# EAGLE design DS1339 RTC Module (EAGLE 9.4.2)
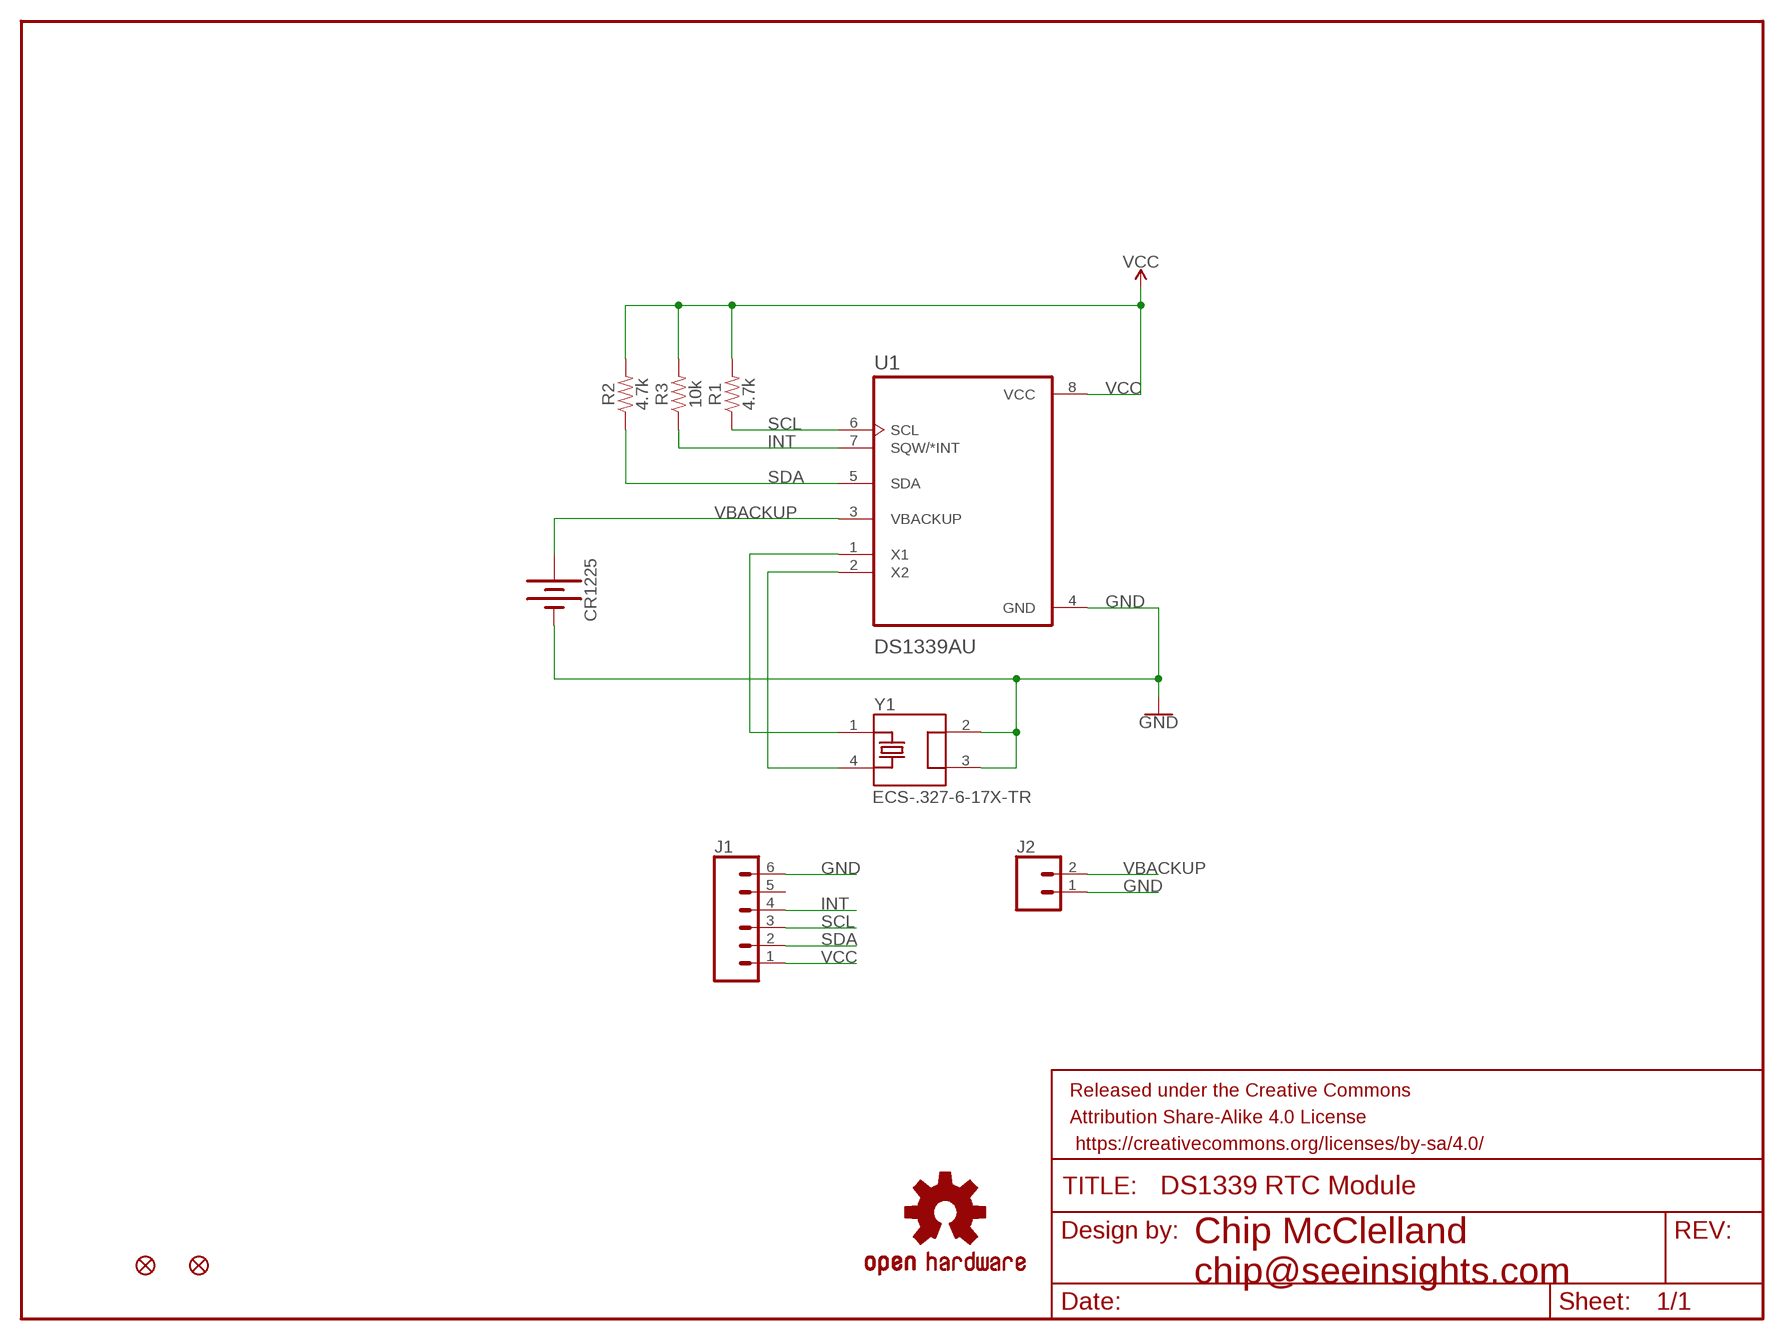
[diagram p0: schematic, sheet 1]

## Parts
CR1225  BATTERY-12MM_SMD  [BATTCON_12MM]
FD1  FIDUCIALUFIDUCIAL  [FIDUCIAL-MICRO]
FD2  FIDUCIALUFIDUCIAL  [FIDUCIAL-MICRO]
FRAME1  FRAME-LETTER  [CREATIVE_COMMONS]
J1  CONN_06LOCK  [1X06_LOCK]
J2  CONN_02  [1X02]
LOGO1  OSHW-LOGOMINI  [OSHW-LOGO-MINI]
R1  4.7k  RESISTOR0805  [0805]
R2  4.7k  RESISTOR0805  [0805]
R3  10k  RESISTOR0805  [0805]
U1  DS1339AU  [SOP65P490X110-8N]
Y1  ECS-.327-6-17X-TR  [XTAL_ECS-.327-6-17X-TR]

## Nets
GND: CR1225.GND(-) J1.6 J2.1 U1.4(GND) Y1.2 Y1.3
INT: J1.4 R3.1 U1.7(SQW/*INT)
N$1: U1.1(X1) Y1.1
N$2: U1.2(X2) Y1.4
SCL: J1.3 R1.1 U1.6(SCL)
SDA: J1.2 R2.1 U1.5(SDA)
VBACKUP: CR1225.PWR@2(+) J2.2 U1.3(VBACKUP)
VCC: J1.1 R1.2 R2.2 R3.2 U1.8(VCC)
Unconnected: J1.5

## Notes on the sheet
- Chip McClelland
  chip@seeinsights.com

## Library data of the parts
CR1225 = DS1339 RTC Library:BATTERY: Battery - Single Cell A variety of battery chemistries, sizes, and footprints. Device List: 20MM_PTH - Coin Cell Battery Holder - 20mm (PTH) <https://www.sparkfun.com/products/783> 20MM_PTH_KIT- Coin Cell battery Holder - 20 mm (PTH) <http://www.sparkfun.com/products/783>kit version with special mask 6.8MM_PTH - Coin Cell Battery Holder - 6.8MM(SMD) <https://www.digikey.com/product-detail/en/seiko-instruments/MS621FE-FL11E/728-1057-ND/1889208?WT.srch=1&gclid=CNOQ5a6LzdQCFZS2wAodXCkE0g> 12MM_SMD - Coin Cell Battery Holder - 12mm (SMD) <https://www.sparkfun.com/products/10592> 12MM_PTH - Coin Cell Battery Holder - 12mm (PTH) <https://www.sparkfun.com/products/7948> 20MM_SMD - 20mm Coin Cell Battery Holder (SMD) (2 legs) Used on the Big Time Watch Kit <https://www.sparkfun.com/products/11734> 20MM_SMD_4LEGS - Coin Cell Battery Holder - 20mm (SMD) <https://www.sparkfun.com/products/11892> 20MM_SMD_4LEGS_OVERPASTE - Coin Cell Battery Holder - 20mm (SMD) <https://www.sparkfun.com/products/11892> (Over-paste on the legs) 24.5MM_PTH - Coin Cell Battery Holder - 24.5mm (PTH) <https://www.sparkfun.com/products/8863> 9V - 9V Battery Holder - PC Mount Used on the SparkFun SparkPunk Sound Kit <https://www.sparkfun.com/products/11177> and SparkFun SparkPunk Sequencer Kit <https://www.sparkfun.com/products/12707> 18650 - Battery Holder - 18650 (PTH) <https://www.sparkfun.com/products/13113> AA - Battery Holder - 1xAA (PTH) <https://www.sparkfun.com/products/7949> AAA - Battery Holder - 1xAAA (PTH) <https://www.sparkfun.com/products/12718> AA_KIT - Battery Holder - 1xAA (PTH) <https://www.sparkfun.com/products/7949> Special kit package - pads only have exposed copper on one side of the board. AAA_KIT - Battery Holder - 1xAAA (PTH) <https://www.sparkfun.com/products/12718> Special kit package - pads only have exposed copper on one side of the board.; PROD_ID: BATT-08044; SF_SKU: PRT-10592
FD1 FD2 = SparkFun-Aesthetics:FIDUCIAL: Fiducial Alignment Points Point-of-reference for pick-and-place machines and other optical instruments.
FRAME1 = SparkFun-Aesthetics:FRAME-LETTER: Schematic Frame - Letter Standard 8.5x11 US Letter frame
J1 = SparkFun-Connectors:CONN_06: Multi connection point. Often used as Generic Header-pin footprint for 0.1 inch spaced/style header connections On any of the 0.1 inch spaced packages, you can populate with these: Break Away Headers - Straight <https://www.sparkfun.com/products/116> (PRT-00116) Break Away Male Headers - Right Angle <https://www.sparkfun.com/products/553> (PRT-00553) Female Headers <https://www.sparkfun.com/products/115> (PRT-00115) Break Away Headers - Machine Pin <https://www.sparkfun.com/products/117> (PRT-00117) Break Away Female Headers - Swiss Machine Pin <https://www.sparkfun.com/products/743> (PRT-00743) Arduino Stackable Header - 6 Pin <https://www.sparkfun.com/products/9280> (PRT-09280) For SCREWTERMINALS and SPRING TERMINALS visit here: Screw Terimnals on SparkFun.com <https://www.sparkfun.com/search/results?term=Screw+Terminals> (5mm/3.5mm/2.54mm spacing) This device is also useful as a general connection point to wire up your design to another part of your project. Our various solder wires solder well into these plated through hole pads. Hook-Up Wire - Assortment (Stranded, 22 AWG) <https://www.sparkfun.com/products/11375> (PRT-11375) Hook-Up Wire - Assortment (Solid Core, 22 AWG) <https://www.sparkfun.com/products/11367> (PRT-11367) View the entire wire category on our website here <https://www.sparkfun.com/categories/141>
J2 = SparkFun-Connectors:CONN_02: Multi connection point. Often used as Generic Header-pin footprint for 0.1 inch spaced/style header connections On any of the 0.1 inch spaced packages, you can populate with these: Break Away Headers - Straight <https://www.sparkfun.com/products/116> (PRT-00116) Break Away Male Headers - Right Angle <https://www.sparkfun.com/products/553> (PRT-00553) Female Headers <https://www.sparkfun.com/products/115> (PRT-00115) Break Away Headers - Machine Pin <https://www.sparkfun.com/products/117> (PRT-00117) Break Away Female Headers - Swiss Machine Pin <https://www.sparkfun.com/products/743> (PRT-00743) For SCREWTERMINALS and SPRING TERMINALS visit here: Screw Terimnals on SparkFun.com <https://www.sparkfun.com/search/results?term=Screw+Terminals> (5mm/3.5mm/2.54mm spacing) This device is also useful as a general connection point to wire up your design to another part of your project. Our various solder wires solder well into these plated through hole pads. Hook-Up Wire - Assortment (Stranded, 22 AWG) <https://www.sparkfun.com/products/11375> (PRT-11375) Hook-Up Wire - Assortment (Solid Core, 22 AWG) <https://www.sparkfun.com/products/11367> (PRT-11367) View the entire wire category on our website here <https://www.sparkfun.com/categories/141> Special notes: Molex polarized connector foot print use with: PRT-08233 with associated crimp pins and housings. 2.54_SCREWTERM for use with PRT-10571. 3.5mm Screw Terminal footprints for PRT-08084 5mm Screw Terminal footprints for use with PRT-08432
LOGO1 = SparkFun-Aesthetics:OSHW-LOGO: Open-Source Hardware (OSHW) Logo This logo indicates the piece of hardware it is found on incorporates a OSHW license and/or adheres to the definition of open source hardware found here: http://freedomdefined.org/OSHW
R1-R3 = SparkFun-Resistors:RESISTOR: Generic Resistor Package
U1 = DS1339 RTC Library:DS1339AU; DESCRIPTION: Real Time Clock Serial 8-Pin uMAX; DIGI-KEY_PART_NUMBER: DS1339AU+-ND; DIGI-KEY_PURCHASE_URL: https://www.digikey.com/product-detail/en/maxim-integrated/DS1339AU-/DS1339AU--ND/3440513?utm_source=snapeda&utm_medium=aggregator&utm_campaign=symbol; MF: Maxim Integrated; MP: DS1339AU+; PACKAGE: &amp;MICRO;MAX-8 Maxim
Y1 = DS1339 RTC Library:ECS-.327-6-17X-TR: Crystal 4-SOJ, 5.50mm pitch; DESCRIPTION: ECX-306X Series 32.768 kHz ±20 ppm 6 pF -40 to +85 °C SMT Tuning Fork Crystal; DIGI-KEY_PART_NUMBER: XC1307CT-ND; DIGI-KEY_PURCHASE_URL: https://www.digikey.com/product-detail/en/ecs-inc/ECS-.327-6-17X-TR/XC1307CT-ND/827771?utm_source=snapeda&utm_medium=aggregator&utm_campaign=symbol; MF: ECS Inc.; MP: ECS-.327-6-17X-TR; PACKAGE: 4-4 ECS International

## Board
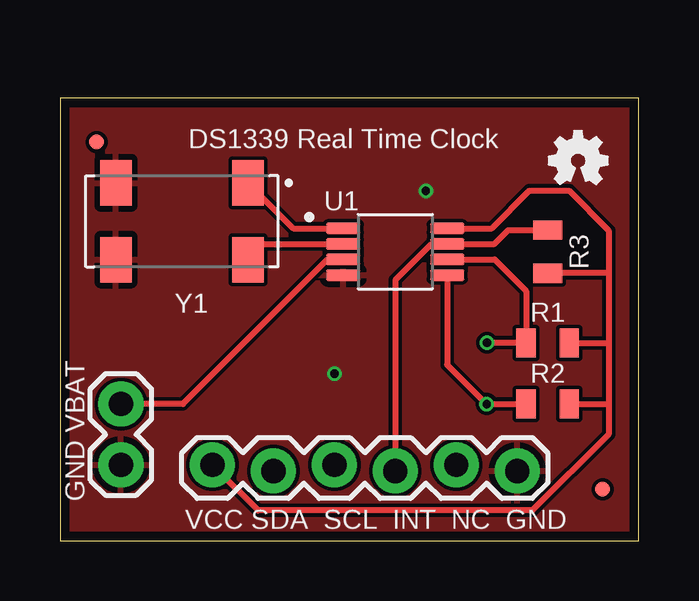
[diagram p1: board, top side]
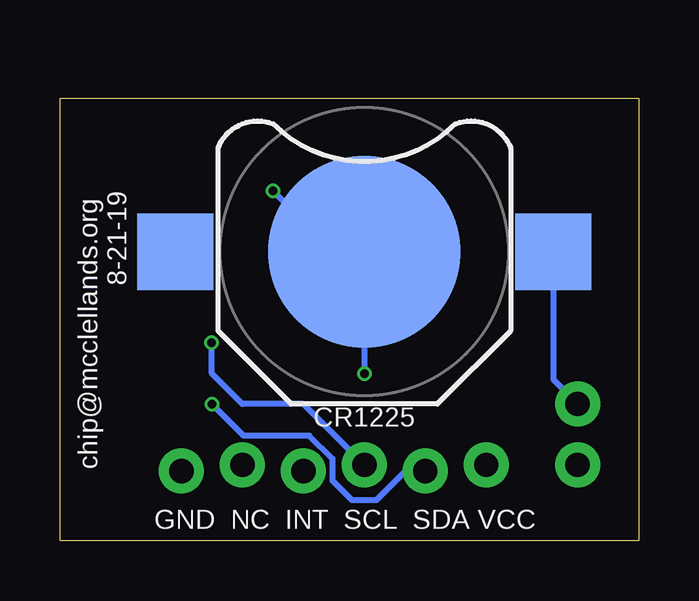
[diagram p2: board, bottom side, seen from below]

Size 24.11 x 18.47 mm. Coordinates in mm from the lower left corner, seen from the top.
Outline: 0,0 24.11,0 24.11,18.47 0,18.47 0,0
Copper layers (1*16): Top 0.035559375mm / dielectric 1.6mm / Bottom 0.035559375mm
Design rules "oshpark-2layer": minimum track width 6mil, minimum drill 10mil, track to track 6mil, track to pad 6mil, pad to pad 6mil, via to via 6mil, smd to smd 6mil, copper to edge 15mil, drill to drill 6mil, minimum pad ring 5mil, minimum via ring 5mil, stop-mask expansion 2.5mil, vias tented up to drill 0mil, thermal gap 10mil

### Footprints (pad centres in the part's own frame; a part is rotated, then mirrored left to right if it is on the bottom)
BATTCON_12MM = smd 8 x 8: GND 0,0 | smd 3.175 x 3.175: PWR@1 -7.874,0; PWR@2 7.874,0
FIDUCIAL-MICRO = smd 0.635 x 0.635: 1 0,0
1X06_LOCK = drill 1.016 pad 1.88: 1 0,0; 2 2.54,-0.254; 3 5.08,0; 4 7.62,-0.254; 5 10.16,0; 6 12.7,-0.254
1X02 = drill 1.016 pad 1.88: 1 0,0; 2 2.54,0
0805 = smd 0.8 x 1.2: 1 -0.9,0; 2 0.9,0
SOP65P490X110-8N = smd 1.42 x 0.47: 1 -2.165,0.975; 2 -2.165,0.325; 3 -2.165,-0.325; 4 -2.165,-0.975; 5 2.165,-0.975; 6 2.165,-0.325; 7 2.165,0.325; 8 2.165,0.975
XTAL_ECS-.327-6-17X-TR = smd 1.3 x 1.9: 1 -2.75,-1.6; 2 2.75,-1.6; 3 2.75,1.6; 4 -2.75,1.6

### Placement (x,y rotation side)
CR1225  11.43,12.06 0 bottom
FD1  22.61,2.16 0 top
FD2  1.52,16.64 0 top
FRAME1  -7.62,-12.7 0 top  (outside the outline)
J1  6.35,3.17 0 top
J2  2.54,3.17 90 top
LOGO1  21.59,15.88 0 top
R1  20.32,8.26 0 top
R2  20.32,5.71 0 top
R3  20.32,12.06 270 top
U1  13.97,12.06 0 top
Y1  5.08,13.34 180 top

### Tracks (layer width: path | path; a pad name or v marks a point on that pad's centre or on a via)
GND  (via drill 0.35)
  Bottom 0.254: v15.24,14.61 11.43,10.79 v11.43,6.99 CR1225.GND
  pour Top: -2.54,20.57 26.67,20.57 26.67,-2.54 -2.54,-2.54
INT
  Top 0.254: R3.1 18.67,12.96 18.09,12.39 U1.7 16.13,12.38 15.47,12.38 13.97,10.88 J1.4
N$1
  Top 0.254: Y1.1 9.72,13.04 U1.1
N$2
  Top 0.254: Y1.4 8.48,12.39 U1.2
SCL  (via drill 0.35)
  Top 0.254: U1.6 18.11,11.74 19.42,10.43 R1.1 19.41,8.27 v17.8,8.27
  Bottom 0.254: J1.3 13.97,5.71 16.51,5.71 17.78,6.99 17.78,8.26 v17.8,8.27
SDA  (via drill 0.35)
  Top 0.254: U1.5 16.14,7.35 17.77,5.71 R2.1 v17.78,5.71
  Bottom 0.254: v17.78,5.71 16.46,4.39 13.72,4.39 12.75,3.43 12.75,2.52 11.94,1.7 10.93,1.7 9.71,2.92 J1.2
VBACKUP
  Top 0.254: J2.2 5.12,5.71 11.14,11.73 U1.3
  Bottom 0.254: CR1225.PWR@2 3.56,6.73 J2.2
VCC
  Top 0.254: U1.8 17.99,13.04 19.56,14.61 21.21,14.61 22.86,12.95 22.86,11.18 | 22.86,8.26 22.86,5.71 | 22.86,5.71 22.86,4.45 19.68,1.27 8.26,1.27 J1.1 | R2.2 22.86,5.71 | R1.2 22.86,8.26 | 22.86,11.18 22.86,8.26 | R3.2 20.33,11.18 22.86,11.18

### Text on the board
tPlace: DS1339 Real Time Clock | GND VBAT | VCC SDA SCL INT NC GND
bPlace: chip@mcclellands.org / 8-21-19 | GND NC INT SCL SDA VCC